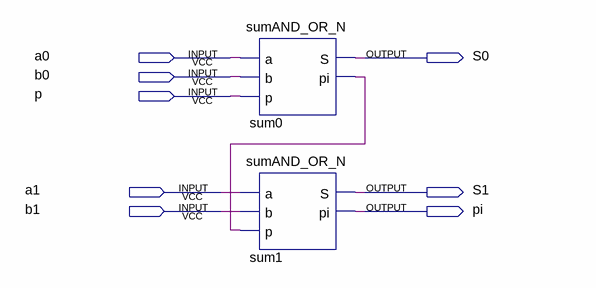
[diagram p0: schematic sheet]
// Quartus schematic sum2.bdf as structural Verilog: 2 symbols, 8 pins
module sum2 (
  input  a0,
  input  b0,
  input  p,
  input  a1,
  input  b1,
  output S0,
  output S1,
  output pi
);

  wire sum0_pi;

  sumAND_OR_N sum0 (.a(a0), .b(b0), .p(p), .S(S0), .pi(sum0_pi));
  sumAND_OR_N sum1 (.a(a1), .b(b1), .p(sum0_pi), .S(S1), .pi(pi));
endmodule
